# Altium schematic sheet MIPI_CSI_DSI.SchDoc: Example Template
size A4; CompanyName: University of Manchester; Engineer: Sam Walsh; Organization: University of Manchester; Address1: L3, 12a Rodborough Rd; Address2: Frenchs Forest; Address3: NSW; Address4: Australia 2086; DocumentNumber: 1; Revision: 0; SheetNumber: 8; SheetTotal: 8; Scale: Ratio
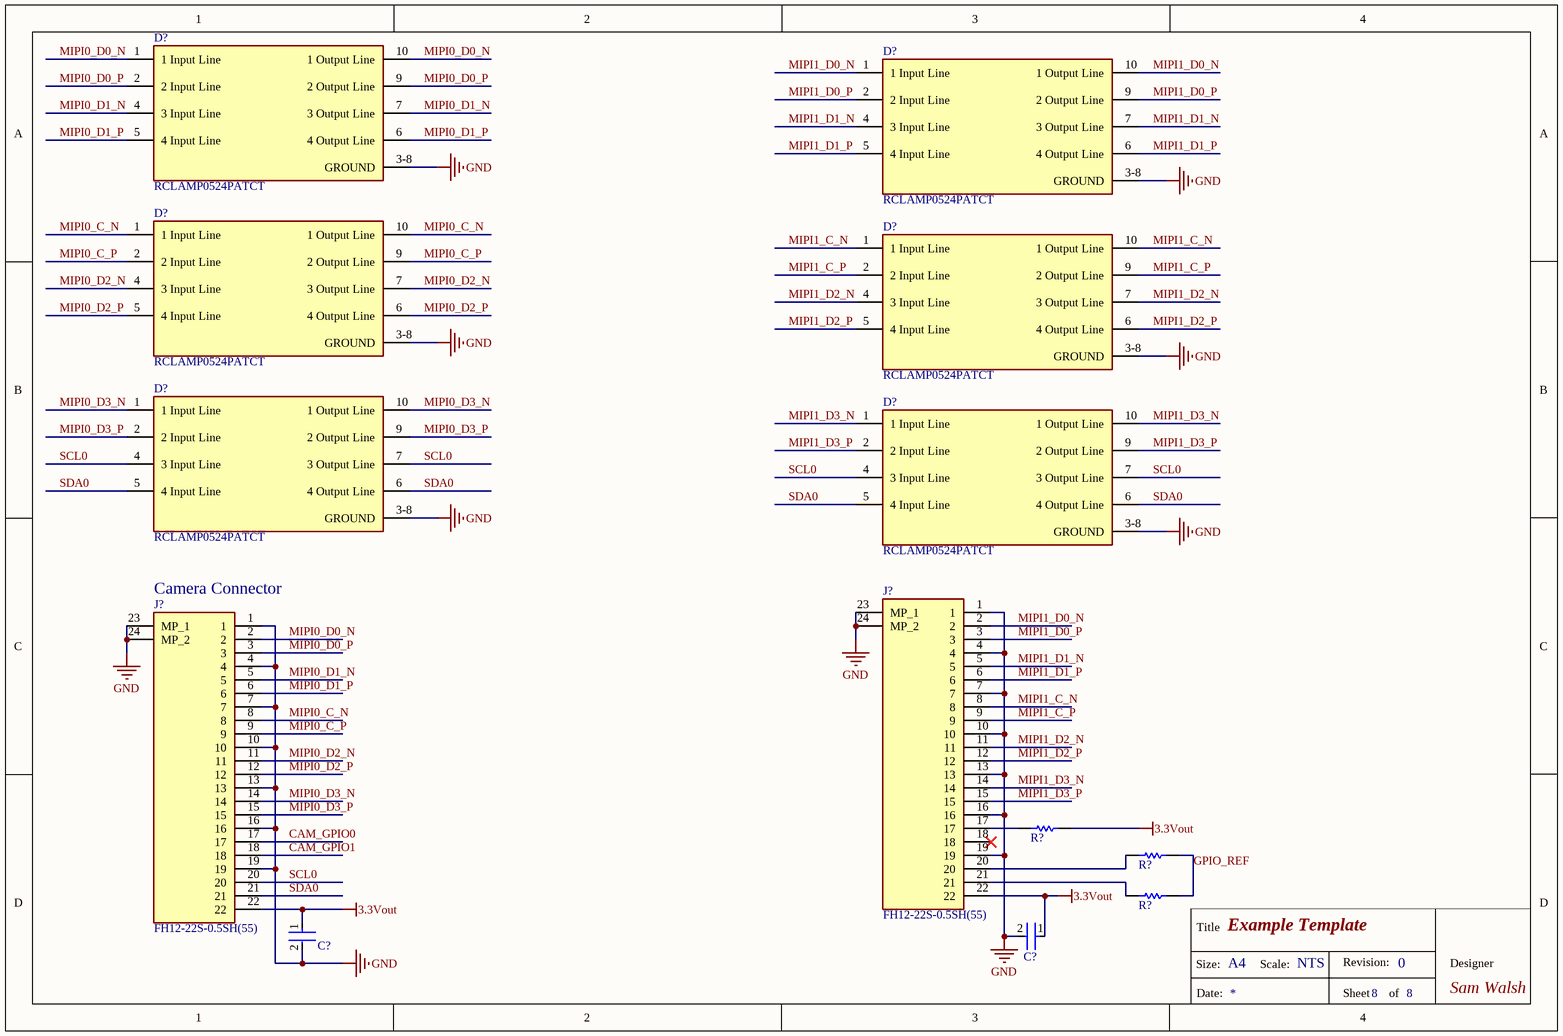
[diagram p0: MIPI_CSI_DSI.SchDoc]

## Parts
(Parts that share a designator on the sheet are numbered #1, #2 ... from top to bottom, then left to right.)
C?#1  CGA3E2X7R1H473M080AD  [FP-CGA3E-0_3-0_1-MFG]  (value not drawn)
C?#2  CGA3E2X7R1H473M080AD  [FP-CGA3E-0_3-0_1-MFG]  (value not drawn)
D?#1  RCLAMP0524PATCT  [FP-SLP2510P8-MFG]
D?#2  RCLAMP0524PATCT  [FP-SLP2510P8-MFG]
D?#3  RCLAMP0524PATCT  [FP-SLP2510P8-MFG]
D?#4  RCLAMP0524PATCT  [FP-SLP2510P8-MFG]
D?#5  RCLAMP0524PATCT  [FP-SLP2510P8-MFG]
D?#6  RCLAMP0524PATCT  [FP-SLP2510P8-MFG]
J?#1  FH12-22S-0.5SH(55)  [FH1222S05SH55]
J?#2  FH12-22S-0.5SH(55)  [FH1222S05SH55]
R?#1  RK73H1JTTD2151F  [RESC1608X55X30ML20T10]  (value not drawn)
R?#2  RK73H1JTTD2151F  [RESC1608X55X30ML20T10]  (value not drawn)
R?#3  RK73H1JTTD2151F  [RESC1608X55X30ML20T10]  (value not drawn)

## Nets
3.3Vout: C?#1.1 C?#2.1 J?#1.22 J?#2.22 R?#1.2
GND: C?#1.2 C?#2.2 D?#1.3-8(GROUND) D?#2.3-8(GROUND) D?#3.3-8(GROUND) D?#4.3-8(GROUND) D?#5.3-8(GROUND) D?#6.3-8(GROUND) J?#1.1 J?#1.4 J?#1.7 J?#1.10 J?#1.13 J?#1.16 J?#1.19 J?#1.23(MP_1) J?#1.24(MP_2) J?#2.1 J?#2.4 J?#2.7 J?#2.10 J?#2.13 J?#2.16 J?#2.19 J?#2.23(MP_1) J?#2.24(MP_2)
CAM_GPIO0: J?#2.17
CAM_GPIO1: J?#2.18
GPIO_REF: R?#2.2 R?#3.2
MIPI0_C_N: D?#3.1(1_Input_Line) D?#3.10(1_Output_Line) J?#2.8
MIPI0_C_P: D?#3.2(2_Input_Line) D?#3.9(2_Output_Line) J?#2.9
MIPI0_D0_N: D?#1.1(1_Input_Line) D?#1.10(1_Output_Line) J?#2.2
MIPI0_D0_P: D?#1.2(2_Input_Line) D?#1.9(2_Output_Line) J?#2.3
MIPI0_D1_N: D?#1.4(3_Input_Line) D?#1.7(3_Output_Line) J?#2.5
MIPI0_D1_P: D?#1.5(4_Input_Line) D?#1.6(4_Output_Line) J?#2.6
MIPI0_D2_N: D?#3.4(3_Input_Line) D?#3.7(3_Output_Line) J?#2.11
MIPI0_D2_P: D?#3.5(4_Input_Line) D?#3.6(4_Output_Line) J?#2.12
MIPI0_D3_N: D?#5.1(1_Input_Line) D?#5.10(1_Output_Line) J?#2.14
MIPI0_D3_P: D?#5.2(2_Input_Line) D?#5.9(2_Output_Line) J?#2.15
MIPI1_C_N: D?#4.1(1_Input_Line) D?#4.10(1_Output_Line) J?#1.8
MIPI1_C_P: D?#4.2(2_Input_Line) D?#4.9(2_Output_Line) J?#1.9
MIPI1_D0_N: D?#2.1(1_Input_Line) D?#2.10(1_Output_Line) J?#1.2
MIPI1_D0_P: D?#2.2(2_Input_Line) D?#2.9(2_Output_Line) J?#1.3
MIPI1_D1_N: D?#2.4(3_Input_Line) D?#2.7(3_Output_Line) J?#1.5
MIPI1_D1_P: D?#2.5(4_Input_Line) D?#2.6(4_Output_Line) J?#1.6
MIPI1_D2_N: D?#4.4(3_Input_Line) D?#4.7(3_Output_Line) J?#1.11
MIPI1_D2_P: D?#4.5(4_Input_Line) D?#4.6(4_Output_Line) J?#1.12
MIPI1_D3_N: D?#6.1(1_Input_Line) D?#6.10(1_Output_Line) J?#1.14
MIPI1_D3_P: D?#6.2(2_Input_Line) D?#6.9(2_Output_Line) J?#1.15
SCL0: D?#5.4(3_Input_Line) D?#5.7(3_Output_Line) D?#6.4(3_Input_Line) D?#6.7(3_Output_Line) J?#2.20
SDA0: D?#5.5(4_Input_Line) D?#5.6(4_Output_Line) D?#6.5(4_Input_Line) D?#6.6(4_Output_Line) J?#2.21
NetJ?#1_17: J?#1.17 R?#1.1
NetJ?#1_20: J?#1.20 R?#2.1
NetJ?#1_21: J?#1.21 R?#3.1

Not connected (* = marked no-connect by the designer): J?#1 18*

## Notes on the sheet
- (near J?#2) Camera Connector
- Size:
- Title
- A4
- Scale:
- NTS
- Revision:
- Designer
- Date:
- Sheet
- of

## Library data of the parts
C?#1 C?#2 = CMP-08246-002396-1: Cap Ceramic 47nF 50V X7R 20% Pad SMD 0603 +125°C Automotive T/R; Package Quantity: 4000; Dielectric: X7R; Capacitance: 47nF; Weight: 7.1E-05oz; Packaging: Tape and Reel; Mount: Surface Mount; Width: 0.8mm; Thickness: 0.031inch; Case Code (Metric): 1608; Tolerance: 20%; Height: 0.8mm; Min Operating Temperature: -55°C; Case/Package: 0603; Voltage Rating: 50V; Length: 0.063inch; Max Operating Temperature: 125°C; Voltage Rating (DC): 50V; Ratings: AEC-Q200; Case Code (Imperial): 0603
D?#1-D?#6 = CMP-56445-000006-1: TVS DIODE 5V 15V SLP2510P8; Number of Unidirectional Channels: 4; Min Breakdown Voltage: 6V; Direction: Unidirectional; Power Line Protection: Yes; Peak Pulse Power: 150W; Leakage Current: 1uA; Capacitance: 0.8pF; Peak Pulse Current: 1A; Series: RailClamp®; Min Operating Temperature: -55°C; Number of Bidirectional Channels: 4; Mount: Surface Mount; Clamping Voltage: 15V; Clamping Voltage-Max: 15V; Max Operating Temperature: 125°C; Working Voltage: 5V; Case/Package: SMD/SMT; Packaging: Tape and Reel; RoHS Compliant: Yes; Reverse Standoff Voltage: 5V; Radiation Hardening: No; Number of Pins: 10; Depth: 1mm; Length: 2.5mm
J?#1 J?#2 = FH12-22S-0.5SH_55: CONN FFC BOTTOM 22POS 0.5MM R/A; Manufacturer_Name: Hirose; Geometry.Height: 2.2mm; Mouser Part Number: 798-FH12-22S-0.5SH55; Mouser Price/Stock: https://www.mouser.co.uk/ProductDetail/Hirose-Connector/FH12-22S-0.5SH55?qs=Ux3WWAnHpjDjN9JNAugKTA%3D%3D; Manufacturer_Part_Number: FH12-22S-0.5SH(55); Datasheet Link: https://www.hirose.com/en/product/document?clcode=CL0586-0532-7-55&productname=FH12-22S-0.5SH(55)&series=FH12&documenttype=2DDrawing&lang=en&documentid=0000987484
R?#1-R?#3 = CMP-2000-01299-1: Manufacturer: KOA Speer; Part Number: RK73H1JTTD2151F